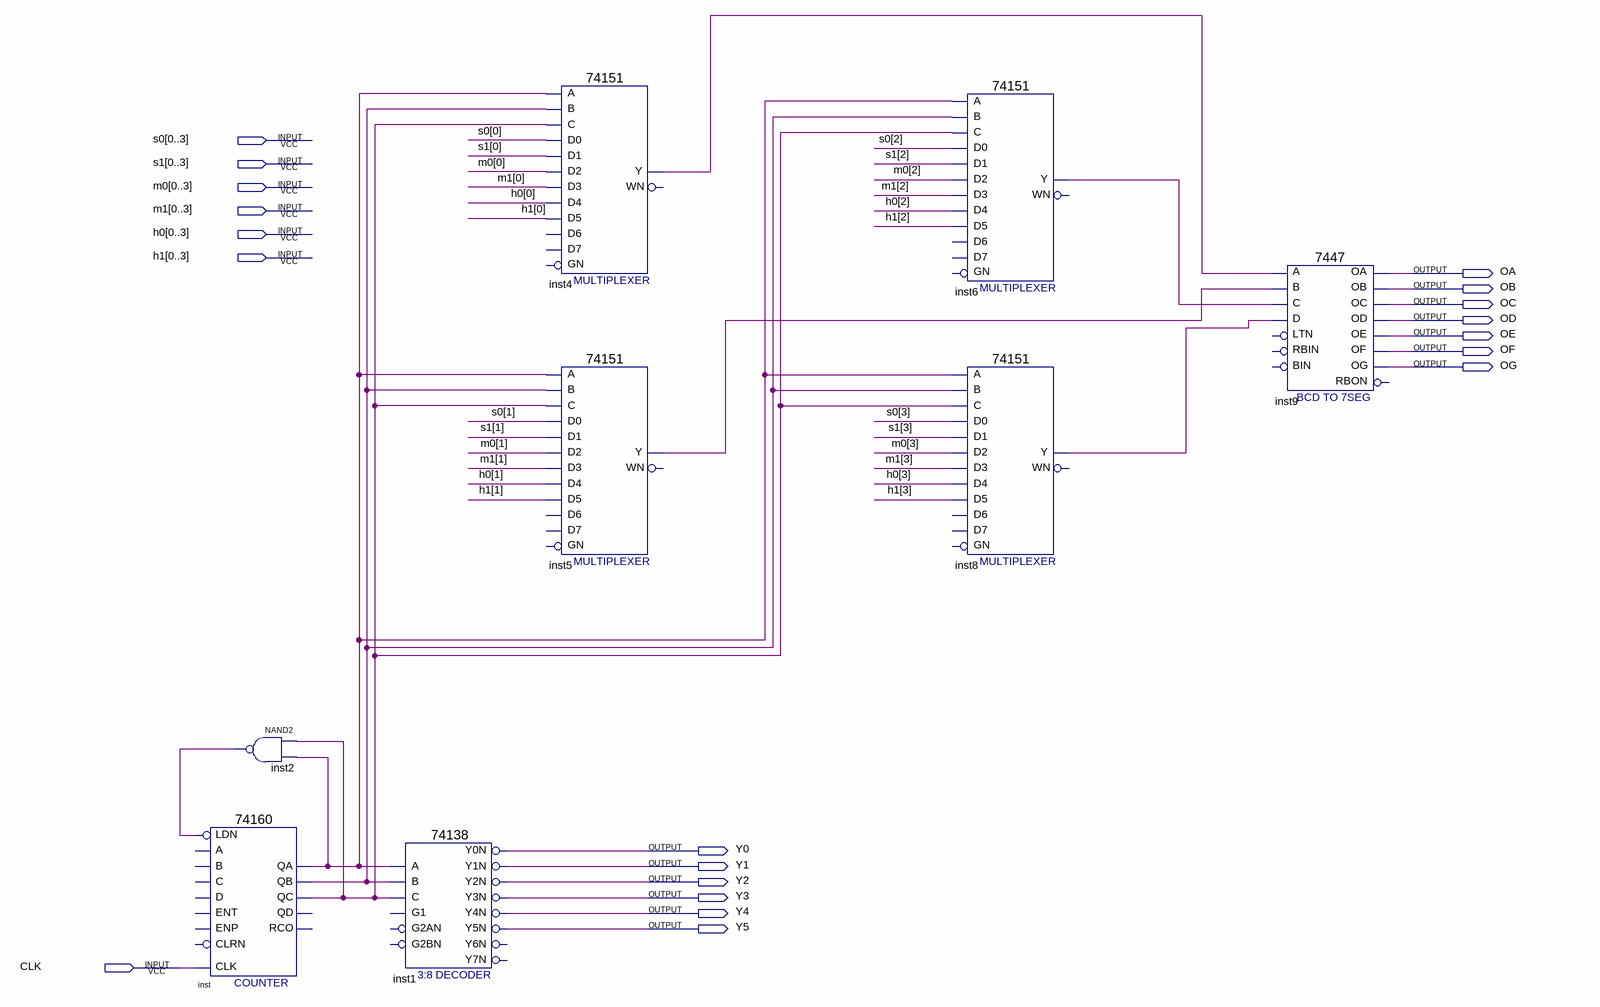
[diagram p0: schematic sheet]
// Quartus schematic DISP.bdf as structural Verilog: 8 symbols, 20 pins
module DISP (
  input  [0:3] s0,
  input  [0:3] s1,
  input  [0:3] m0,
  input  [0:3] m1,
  input  [0:3] h0,
  input  [0:3] h1,
  input  CLK,
  output OA,
  output OB,
  output OC,
  output OD,
  output OE,
  output OF,
  output OG,
  output Y0,
  output Y1,
  output Y2,
  output Y3,
  output Y4,
  output Y5
);

  wire inst2_out, inst4_y, inst5_y, inst6_y, inst8_y, inst_qa, inst_qb, inst_qc;

  \74160  inst (
    .CLK(CLK), .LDN(inst2_out), .QA(inst_qa), .QB(inst_qb), .QC(inst_qc));  // open: ENT, A, B, C, D, ENP, CLRN, QD, RCO
  nand inst2 (inst2_out, inst_qc, inst_qa);
  \74138  inst1 (
    .A(inst_qa), .B(inst_qb), .C(inst_qc), .Y0N(Y0), .Y1N(Y1), .Y2N(Y2), .Y3N(Y3), .Y4N(Y4), .Y5N(Y5));  // open: G1, G2AN, G2BN, Y6N, Y7N
  \74151  inst4 (
    .C(inst_qc), .B(inst_qb), .A(inst_qa), .D5(h1[0]), .D0(s0[0]), .D1(s1[0]), .D4(h0[0]), .D3(m1[0]),
    .D2(m0[0]), .Y(inst4_y));  // open: GN, D6, D7, WN
  \74151  inst5 (
    .C(inst_qc), .B(inst_qb), .A(inst_qa), .D5(h1[1]), .D0(s0[1]), .D1(s1[1]), .D4(h0[1]), .D3(m1[1]),
    .D2(m0[1]), .Y(inst5_y));  // open: GN, D6, D7, WN
  \74151  inst6 (
    .C(inst_qc), .B(inst_qb), .A(inst_qa), .D5(h1[2]), .D0(s0[2]), .D1(s1[2]), .D4(h0[2]), .D3(m1[2]),
    .D2(m0[2]), .Y(inst6_y));  // open: GN, D6, D7, WN
  \74151  inst8 (
    .C(inst_qc), .B(inst_qb), .A(inst_qa), .D5(h1[3]), .D0(s0[3]), .D1(s1[3]), .D4(h0[3]), .D3(m1[3]),
    .D2(m0[3]), .Y(inst8_y));  // open: GN, D6, D7, WN
  \7447  inst9 (
    .B(inst5_y), .C(inst6_y), .D(inst8_y), .A(inst4_y), .OB(OB), .OC(OC), .OE(OE), .OD(OD), .OF(OF), .OG(OG),
    .OA(OA));  // open: LTN, RBIN, BIN, RBON
endmodule
